# Altium schematic sheet COM.SchDoc
size A3
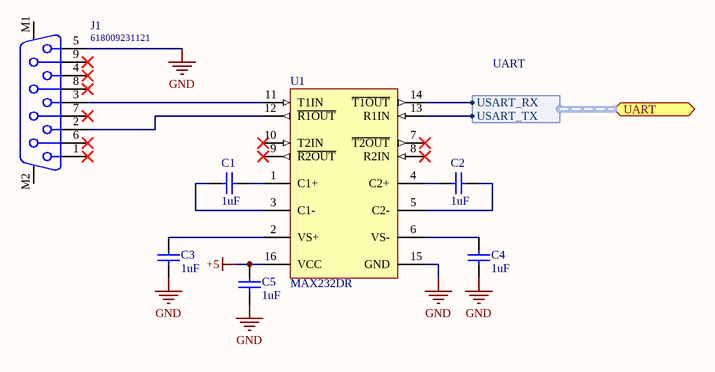
[diagram p0: COM.SchDoc]

## Parts
C1  1uF  [CAP_0603i_1608m -N]
C2  1uF  [CAP_0603i_1608m -N]
C3  1uF  [CAP_0603i_1608m -N]
C4  1uF  [CAP_0603i_1608m -N]
C5  1uF  [CAP_0603i_1608m -N]
J1  618009231121  [618009231121]
U1  MAX232DR  [D0016A_N]

## Ports
UART (bidir, harness UART)

## Harnesses
UART: USART_RX, USART_TX

## Nets
 +5: C5.2 U1.16(VCC)
GND: C3.1 C4.1 C5.1 J1.5 U1.15(GND)
NetC1_1: C1.1 U1.1(C1+)
NetC1_2: C1.2 U1.3(C1-)
NetC2_1: C2.1 U1.5(C2-)
NetC2_2: C2.2 U1.4(C2+)
NetC3_2: C3.2 U1.2(VS+)
NetC4_2: C4.2 U1.6(VS-)
NetJ1_2: J1.2 U1.12(~{R1OUT})
NetJ1_3: J1.3 U1.11(T1IN)
NetU1_13: U1.13(R1IN) ; port UART.USART_TX
NetU1_14: U1.14(~{T1OUT}) ; port UART.USART_RX

Not connected (* = marked no-connect by the designer): J1 1* 4* 6* 7* 8* 9* M1 M2; U1 7(~{T2OUT})* 8(R2IN)* 9(~{R2OUT})* 10(T2IN)*

## Notes on the sheet
- 1
- 2
- 3
- 4
- 5
- 6
- 7
- 8
- A
- B
- C
- D
- Project:
- Date:
- Drawing number:
- Rev:
- Format:
- A3
- Drawn by:
- Laboratory:
- Page
- Sheet:
- of
- File:

## Library data of the parts
C1-C5 = Cap: capacitor
J1 = CMP-1502-00200-1: Female PCB Connector with Hex Screw WR-DSUB, 8.08 mm, Angled, 9 pins; Manufacturer: Wurth Elektronik; Contact Resistance: 30mOhm; Pin Number: 9; Working Voltage: 125VAC; Rated Current: 3A; Gender: Female; Datasheet URL: https://katalog.we-online.de/em/datasheet/6180xx231121.pdf; Packaging: Tray; Package Reference: 618009231121; Operating Temperature: -40to85degC; Manufacturer URL: http://www.we-online.de; Publisher: WurthElektronik; Mounting Technology: THT; Part Number: 618009231121; Orientation: Angled
U1 = CMP-0299-00150-2: Dual EIA-232 Driver / Receiver, 0 to 70 degC, 16-Pin SOIC (D), Green (RoHS & no Sb/Br); Single Supply: TRUE; Supply Voltage(s)(V): 5; SubFamily: RS-232; Drivers Per Package: 2; ICC(Max)(mA): 10; ESD HBM(kV): +/-2; ComponentLink1Description: Manufacturer URL; ComponentLink2Description: Datasheet; RS-232: TRUE; ComponentLink3URL: http://www.ti.com/litv/pdf/mpds178g; DatasheetVersion: SLLS047L; ComponentLink1URL: www.ti.com; PackageDescription: 16-Pin Plastic Small Outline Integrated Circuit, 9.9 x 3.9 mm, Pitch 1.27 mm Pitch; PackageVersion: revM, Jun-2011; ComponentLink2URL: http://www.ti.com/general/docs/lit/getliterature.tsp?genericPartNumber=MAX232&fileType=pdf; ComponentLink3Description: Package Specification; PackageReference: D0016A; Receivers Per Package: 2